# Altium schematic sheet gap.SchDoc: GAPMod
size A4; SheetNumber: 4; SheetTotal: 11
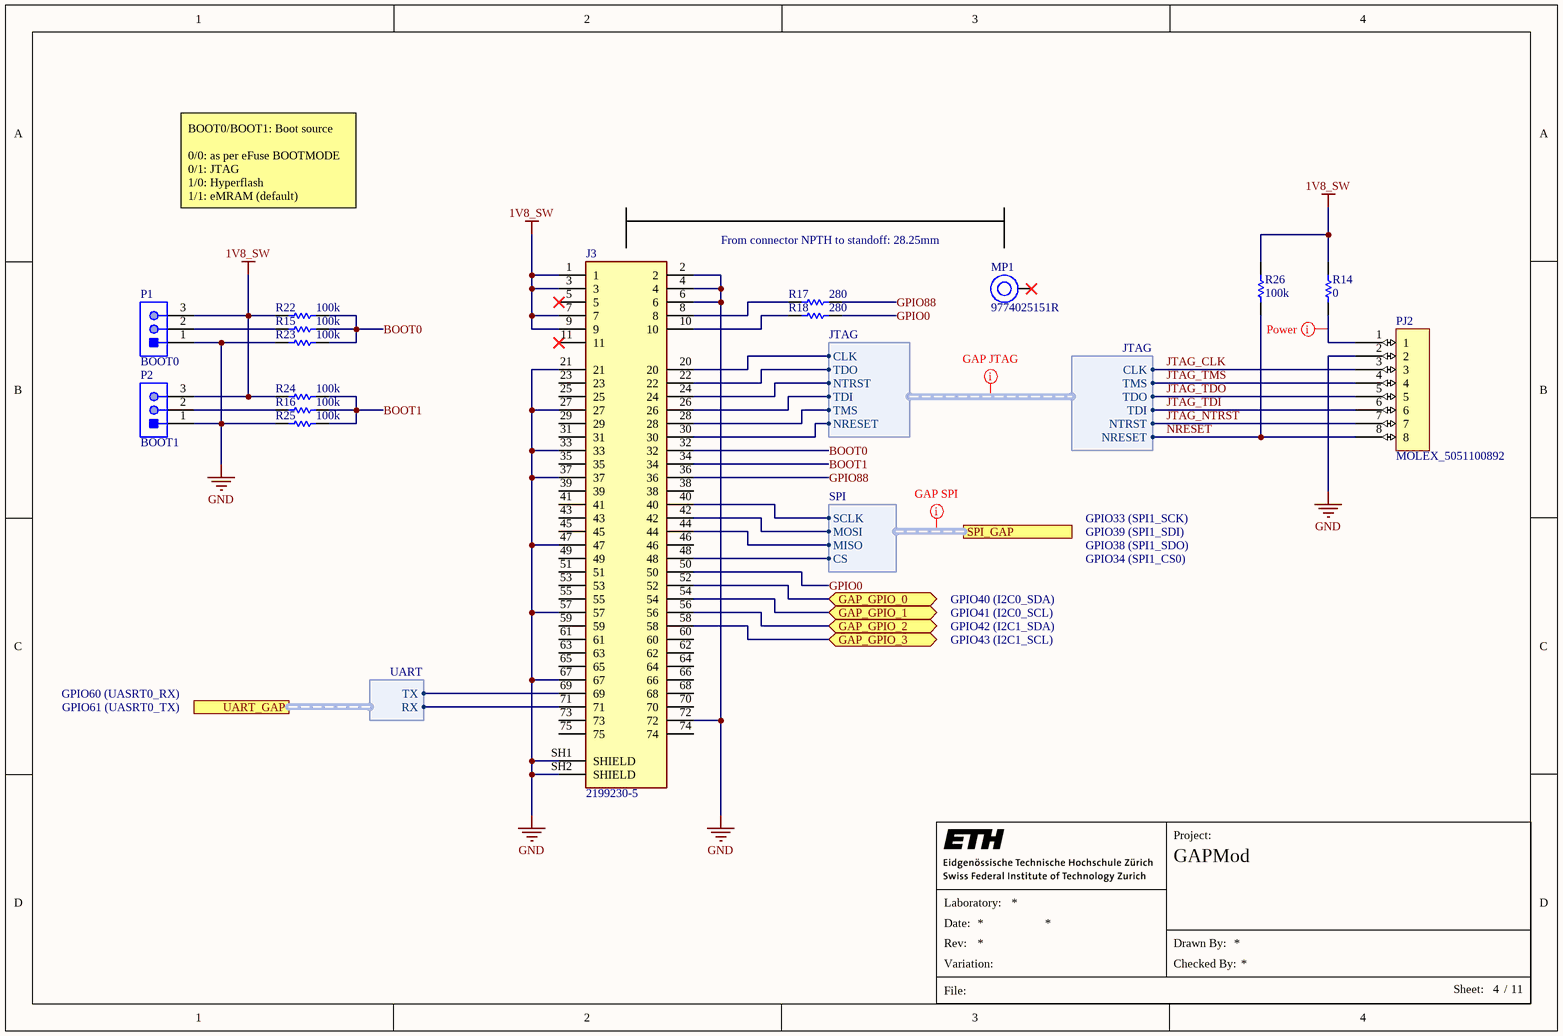
[diagram p0: gap.SchDoc]

## Parts
J3  2199230-5  [TE_2199230-5]
MP1  9774025151R  [9774025151]
P1  BOOT0  [SLIN-GRPB031VWVN-RC_V]
P2  BOOT1  [SLIN-GRPB031VWVN-RC_V]
PJ2  MOLEX_5051100892  [MOLEX_5051100892]
R14  value 0  [RESC1005X40X25ML05T10]  (hidden comment: Resistor 0R 0402 63 mW)
R15  100k  [RESC1005X40X25NL05T10]
R16  100k  [RESC1005X40X25NL05T10]
R17  280  [RESC1005X40X25NL05T10]
R18  280  [RESC1005X40X25NL05T10]
R22  100k  [RESC1005X40X25NL05T10]
R23  100k  [RESC1005X40X25NL05T10]
R24  100k  [RESC1005X40X25NL05T10]
R25  100k  [RESC1005X40X25NL05T10]
R26  100k  [RESC1005X40X25NL05T10]

## Ports
GAP_GPIO_0 (bidir, see main[6B], io_a[3B], power_io[6B]), GAP_GPIO_1 (bidir, see main[6B], io_a[3B], power_io[6B]), GAP_GPIO_2 (bidir, see main[6B], io_a[3B], power_io[6B]), GAP_GPIO_3 (bidir, see main[6B], io_a[3B], power_io[6B]), SPI_GAP (harness SPI, see main[6B], io_a[3B], power_io[6B]), UART_GAP (harness UART, see main[6B], io_a[3B], power_io[6B])

## Harnesses
SPI: SCLK, MISO, MOSI, CS
JTAG: CLK, TDO, NTRST, TDI, TMS, NRESET
UART: TX, RX

## Nets
1V8_SW: J3.1 J3.3 J3.7 J3.9 P1.3 P2.3 R14.2 R22.2 R24.2 R26.2
GND: J3.2 J3.4 J3.6 J3.21 J3.27 J3.33 J3.37 J3.47 J3.57 J3.67 J3.72 J3.SH1(SHIELD) J3.SH2(SHIELD) P1.1 P2.1 PJ2.2 R23.2 R25.2
BOOT0: J3.32 R15.1 R22.1 R23.1
BOOT1: J3.34 R16.1 R24.1 R25.1
GAP_GPIO_0: J3.52 ; port GAP_GPIO_0
GAP_GPIO_1: J3.54 ; port GAP_GPIO_1
GAP_GPIO_2: J3.56 ; port GAP_GPIO_2
GAP_GPIO_3: J3.58 ; port GAP_GPIO_3
GPIO0: J3.50 R18.2
GPIO88: J3.36 R17.2
JTAG_CLK: J3.20 PJ2.3 ; harness JTAG.CLK
JTAG_NTRST: J3.24 PJ2.7 ; harness JTAG.NTRST
JTAG_TDI: J3.26 PJ2.6 ; harness JTAG.TDI
JTAG_TDO: J3.22 PJ2.5 ; harness JTAG.TDO
JTAG_TMS: J3.28 PJ2.4 ; harness JTAG.TMS
NRESET: J3.30 PJ2.8 R26.1 ; harness JTAG.NRESET
NetJ3_8: J3.8 R17.1
NetJ3_10: J3.10 R18.1
NetJ3_40: J3.40 ; port SPI_GAP.SCLK
NetJ3_42: J3.42 ; port SPI_GAP.MOSI
NetJ3_44: J3.44 ; port SPI_GAP.MISO
NetJ3_48: J3.48 ; port SPI_GAP.CS
NetJ3_69: J3.69 ; port UART_GAP.TX
NetJ3_71: J3.71 ; port UART_GAP.RX
NetP1_2: P1.2 R15.2
NetP2_2: P2.2 R16.2
NetPJ2_1: PJ2.1 R14.1

Not connected (* = marked no-connect by the designer): J3 5* 11* 23 25 29 31 35 38 39 41 43 45 46 49 51 53 55 59 60 61 62 63 64 65 66 68 70 73 74 75; MP1 1*

## Layout directives
net class Power: NetPJ2_1
net class JTAG_GAP: (no net found under the mark)
net class SPI_GAP: (no net found under the mark)

## Notes on the sheet
- BOOT0/BOOT1: Boot source
  0/0: as per eFuse BOOTMODE
  0/1: JTAG
  1/0: Hyperflash
  1/1: eMRAM (default)
- From connector NPTH to standoff: 28.25mm
- GPIO33 (SPI1_SCK)
- GPIO39 (SPI1_SDI)
- GPIO38 (SPI1_SDO)
- GPIO34 (SPI1_CS0)
- GPIO40 (I2C0_SDA)
- GPIO41 (I2C0_SCL)
- GPIO42 (I2C1_SDA)
- GPIO43 (I2C1_SCL)
- GPIO60 (UASRT0_RX)
- GPIO61 (UASRT0_TX)
- Project:
- Laboratory:
- Date:
- File:
- Rev:
- Variation:
- Drawn By:
- Checked By:
- Sheet:
- /

## Library data of the parts
J3 = 2199230-5: Conn Card Edge 67 POS 0.5mm Solder RA SMD Embossed T/R; MF: {'manufacturer': u'TE Connectivity'}; Package: None; Price: None; Value: *; MP: 2199230-5; Availability: Unavailable
MP1 = CMP-03913-59774856-1: 9774025151R Spacer Material: Steel Mounting: SMT Series: WA-SMSI Thread D: M2.5; Plating: Tin; Threaded/Unthreaded: Threaded; Outside Diameter: 5.1054mm; REACH SVHC: Unknown; Packaging: Tape and Reel; Height: 2.6mm; Min Operating Temperature: -55°C; NexarPartId: 59774856; Max Operating Temperature: 150°C; RoHS: Compliant; Length: 2.5mm; Material: Steel
P1 P2 = CMP-2000-06372-1: Male Header, Pitch 1.27 mm, 1 x 3 Position, Height 4 mm, Tail Length 2.3 mm, -40 to 105 degC, RoHS, Bulk; Manufacturer: Sullins; Other Names: S9014E-03; Number of Positions: 3; Connector Type: Header,Unshrouded; Pitch: 0.050"(1.27mm); Dynamic Catalog: GRPB; Catalog Drawings: S9014ESeriesTop; Mating Products: S9010E-03-ND / -CONNHEADER.050"3POSR/APCB / S9008E-03-ND / -CONNHEADER.050"3POSPCBGOLD / S9005E-03-ND / -CONNHEADER.050"3POSSMDGOLD; Number of Positions Loaded: All; Contact Finish: Gold; Mounting Type: ThroughHole; Termination: Solder; Packaging: Bulk; Category: Connectors,Interconnects; Package Description: Male Header, Pitch 1.27 mm, 1 x 3 Position, Height 4 mm, Tail Length 2.3 mm; Standard Package: 1; Datasheet URL: http://www.sullinscorp.com/drawings/71_GRPB___1VWVN-RC,_10957-C.pdf; Package Reference: GRPB031VWVN-RC; Family: RectangularConnectors-Headers,MalePins; Number of Rows: 1; Contact Type: MalePin; Manufacturer URL: http://www.sullinscorp.com/; Mounting Technology: ThroughHole; Contact Mating Length: 0.118"(3.00mm); Contact Finish Thickness: Flash; Datasheet Version: Rev. C, 12/2008
R14 = CMP-009-00004-5: Chip Resistor, 0 Ohm, 0.063 W, -55 to 155 degC, 0402 (1005 Metric); Power: 63mW; Voltage Rating: 50V; Max Operating Temperature: 155°C; Pins: 2; RoHS Compliant: True; Min Operating Temperature: -55°C; Mounting Technology: SM; Case/Package: 0402
R15 R16 R22-R26 = CMP-2002-07343-1: Part Number: RC0402FR-07100KL; Manufacturer: Yageo / Phycomp
R17 R18 = CMP-1011-00446-2: Manufacturer: Yageo; Part Number: RC0402FR-07280RL